# Altium schematic sheet Sheet3_MCU.SchDoc: =ProjectName
size A4; DocumentNumber: 3; SheetNumber: 3; SheetTotal: 4
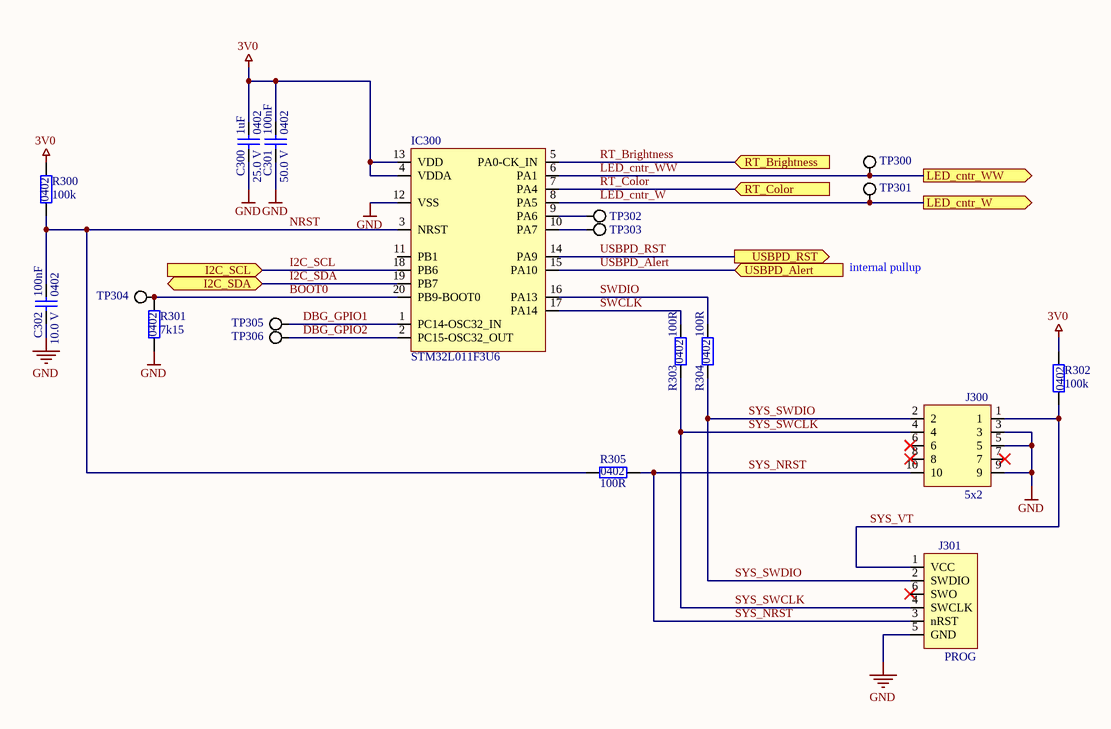
[diagram p0: Sheet3_MCU.SchDoc]

## Parts
C300  Capacitance: 1uF  Footprint: 0402  Voltage: 25.0 V  [C_0402]  (hidden comment: C 1uF 0402 25V)
C301  Capacitance: 100nF  Footprint: 0402  Voltage: 50.0 V  [C_0402]  (hidden comment: C 100nF 0402 50V)
C302  Capacitance: 100nF  Footprint: 0402  Voltage: 10.0 V  [C_0402]  (hidden comment: C 100nF 0402 10V)
IC300  STM32L011F3U6  [UFQFN-20]
J300  5x2  [J_MH5x2_1.27-STM32]
J301  PROG  [J_TC2030-IDC-NL]  (no BOM)
R300  Resistance: 100k  Footprint: 0402  [R_0402]  (hidden comment: R 100k 0402)
R301  Resistance: 7k15  Footprint: 0402  [R_0402]  (hidden comment: R 7k15 0402)
R302  Resistance: 100k  Footprint: 0402  [R_0402]  (hidden comment: R 100k 0402)
R303  Resistance: 100R  Footprint: 0402  [R_0402]  (hidden comment: R 100R 0402)
R304  Resistance: 100R  Footprint: 0402  [R_0402]  (hidden comment: R 100R 0402)
R305  Resistance: 100R  Footprint: 0402  [R_0402]  (hidden comment: R 100R 0402)
TP300  TP  [TP_1mm]  (value not drawn)  (net tie, no BOM)
TP301  TP  [TP_1mm]  (value not drawn)  (net tie, no BOM)
TP302  TP  [TP_1mm]  (value not drawn)  (net tie, no BOM)
TP303  TP  [TP_1mm]  (value not drawn)  (net tie, no BOM)
TP304  TP  [TP_1mm]  (value not drawn)  (net tie, no BOM)
TP305  TP  [TP_1mm]  (value not drawn)  (net tie, no BOM)
TP306  TP  [TP_1mm]  (value not drawn)  (net tie, no BOM)

## Ports
I2C_SCL (in), I2C_SDA (bidir), LED_cntr_W (out), LED_cntr_WW (out), RT_Brightness (in), RT_Color (in), USBPD_Alert (in), USBPD_RST (out)

## Nets
3V0: C300.2 C301.2 IC300.4(VDDA) IC300.13(VDD) R300.2 R302.1
GND: C300.1 C301.1 C302.1 IC300.12(VSS) J300.3 J300.5 J300.9 J301.5(GND) R301.1
BOOT0: IC300.20(PB9-BOOT0) R301.2 TP304.1(TP)
DBG_GPIO1: IC300.1(PC14-OSC32_IN) TP305.1(TP)
DBG_GPIO2: IC300.2(PC15-OSC32_OUT) TP306.1(TP)
I2C_SCL: IC300.18(PB6) ; port I2C_SCL
I2C_SDA: IC300.19(PB7) ; port I2C_SDA
LED_cntr_W: IC300.8(PA5) TP301.1(TP) ; port LED_cntr_W
LED_cntr_WW: IC300.6(PA1) TP300.1(TP) ; port LED_cntr_WW
NRST: C302.2 IC300.3(NRST) R300.1 R305.1
RT_Brightness: IC300.5(PA0-CK_IN) ; port RT_Brightness
RT_Color: IC300.7(PA4) ; port RT_Color
SWCLK: IC300.17(PA14) R303.2
SWDIO: IC300.16(PA13) R304.2
SYS_NRST: J300.10 J301.3(nRST) R305.2
SYS_SWCLK: J300.4 J301.4(SWCLK) R303.1
SYS_SWDIO: J300.2 J301.2(SWDIO) R304.1
SYS_VT: J300.1 J301.1(VCC) R302.2
USBPD_Alert: IC300.15(PA10) ; port USBPD_Alert
USBPD_RST: IC300.14(PA9) ; port USBPD_RST
NetIC300_9: IC300.9(PA6) TP302.1(TP)
NetIC300_10: IC300.10(PA7) TP303.1(TP)

Not connected (* = marked no-connect by the designer): IC300 11(PB1); J300 6* 7* 8*; J301 6(SWO)*

## Notes on the sheet
- internal pullup
- Title
- Size:
- Date:
- A4
- Number:
- Time:
- Revision:
- Sheet
- of
- File:

## Library data of the parts
C300 = CAP_1uF_25V_0402: CAP CER 1UF 25V X5R 0402; Manufacturer: Taiyo Yuden; Manufacturer Part Number: TMK105BJ105MV-F; Type: Capacitor; Supplier 1: Digi-Key; Supplier Part Number 1: 587-3245-1-ND
C301 = CAP_100nF_50V_0402: CAP CER 0.1UF 50V X7R 0402; Manufacturer: Murata Electronics; Manufacturer Part Number: GRM155R71H104KE14J; Type: Capacitor; Supplier 1: Digi-Key; Supplier Part Number 1: 490-13342-1-ND
C302 = CAP_100nF_10V_0402: CAP CER 0.1UF 10V X5R 0402; Manufacturer: Samsung Electro-Mechanics; Manufacturer Part Number: CL05A104MP5NNNC; Type: Capacitor; Supplier 1: Digi-Key; Supplier Part Number 1: 1276-1443-1-ND
IC300 = IC_MCU_STM32L011F3U6: IC MCU 32BIT 8KB FLASH 20UFQFPN; Manufacturer: STMicroelectronics; Manufacturer Part Number: STM32L011F3U6TR; Type: IC, MCU; Supplier 1: Digikey; Supplier Part Number 1: 497-18800-2-ND
J300 = J_MH5x2_1.27: CONN HEADER SMD 10POS 1.27MM; Manufacturer: Sullins Connector Solutions; Manufacturer Part Number: GRPB052VWQS-RC; Pitch: 1.27; Type: Connector; Supplier 1: Digi-Key; Supplier Part Number 1: S9012E-05-ND; Pins: 10
J301 = J_TC2030-IDC-NL: SWD Programmer No Legs; Manufacturer: Tag_connect; Manufacturer Part Number: TC2030; Type: Connector; Pins: 3
R300 R302 = R_100k_0402: RES 100K OHM 5% 1/16W 0402; Manufacturer: YAGEO; Manufacturer Part Number: RC0402JR-07100KL; Type: Resistor; Supplier 1: Digi-Key; Supplier Part Number 1: 311-100KJRCT-ND
R301 = R_7k15_0402: RES 7.15K OHM 1% 1/16W 0402; Manufacturer: Stackpole Electronics Inc; Manufacturer Part Number: RMCF0402FT7K15; Type: Resistor; Supplier 1: Digi-Key; Supplier Part Number 1: RMCF0402FT7K15CT-ND
R303-R305 = R_100R_0402: RES 100 OHM 1% 1/16W 0402; Manufacturer: Stackpole Electronics Inc; Manufacturer Part Number: RMCF0402FT100R; Type: Resistor; Supplier 1: Digi-Key; Supplier Part Number 1: RMCF0402FT100RCT-ND
TP300-TP306 = TP_1mm: Test Point 1mm